# Altium schematic sheet Pressure_sensors.SchDoc
size A; SheetNumber: 4; SheetTotal: 7
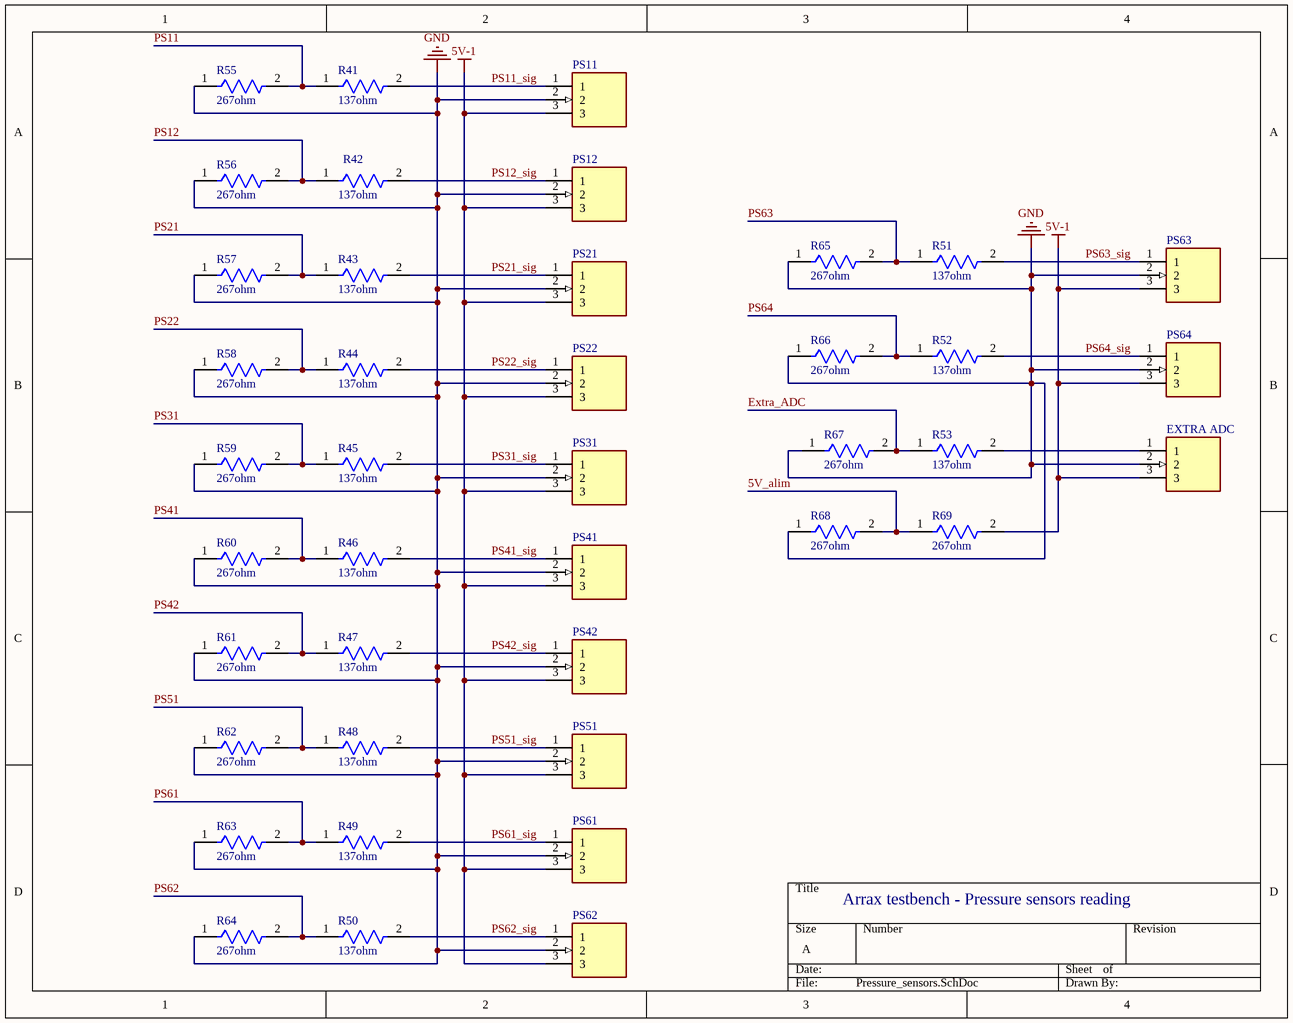
[diagram p0: Pressure_sensors.SchDoc]

## Parts
EXTRA_ADC  640456-3  [HDRV3W107P0X254_1X3_762X572X1080P]  (value not drawn)
PS11  640456-3  [HDRV3W107P0X254_1X3_762X572X1080P]  (value not drawn)
PS12  640456-3  [HDRV3W107P0X254_1X3_762X572X1080P]  (value not drawn)
PS21  640456-3  [HDRV3W107P0X254_1X3_762X572X1080P]  (value not drawn)
PS22  640456-3  [HDRV3W107P0X254_1X3_762X572X1080P]  (value not drawn)
PS31  640456-3  [HDRV3W107P0X254_1X3_762X572X1080P]  (value not drawn)
PS41  640456-3  [HDRV3W107P0X254_1X3_762X572X1080P]  (value not drawn)
PS42  640456-3  [HDRV3W107P0X254_1X3_762X572X1080P]  (value not drawn)
PS51  640456-3  [HDRV3W107P0X254_1X3_762X572X1080P]  (value not drawn)
PS61  640456-3  [HDRV3W107P0X254_1X3_762X572X1080P]  (value not drawn)
PS62  640456-3  [HDRV3W107P0X254_1X3_762X572X1080P]  (value not drawn)
PS63  640456-3  [HDRV3W107P0X254_1X3_762X572X1080P]  (value not drawn)
PS64  640456-3  [HDRV3W107P0X254_1X3_762X572X1080P]  (value not drawn)
R41  137ohm  [FP-RP73P-2A-MFG]
R42  137ohm  [FP-RP73P-2A-MFG]
R43  137ohm  [FP-RP73P-2A-MFG]
R44  137ohm  [FP-RP73P-2A-MFG]
R45  137ohm  [FP-RP73P-2A-MFG]
R46  137ohm  [FP-RP73P-2A-MFG]
R47  137ohm  [FP-RP73P-2A-MFG]
R48  137ohm  [FP-RP73P-2A-MFG]
R49  137ohm  [FP-RP73P-2A-MFG]
R50  137ohm  [FP-RP73P-2A-MFG]
R51  137ohm  [FP-RP73P-2A-MFG]
R52  137ohm  [FP-RP73P-2A-MFG]
R53  137ohm  [FP-RP73P-2A-MFG]
R55  267ohm  [FP-RP73P-2A-MFG]
R56  267ohm  [FP-RP73P-2A-MFG]
R57  267ohm  [FP-RP73P-2A-MFG]
R58  267ohm  [FP-RP73P-2A-MFG]
R59  267ohm  [FP-RP73P-2A-MFG]
R60  267ohm  [FP-RP73P-2A-MFG]
R61  267ohm  [FP-RP73P-2A-MFG]
R62  267ohm  [FP-RP73P-2A-MFG]
R63  267ohm  [FP-RP73P-2A-MFG]
R64  267ohm  [FP-RP73P-2A-MFG]
R65  267ohm  [FP-RP73P-2A-MFG]
R66  267ohm  [FP-RP73P-2A-MFG]
R67  267ohm  [FP-RP73P-2A-MFG]
R68  267ohm  [FP-RP73P-2A-MFG]
R69  267ohm  [FP-RP73P-2A-MFG]

## Nets
5V-1: EXTRA_ADC.3 PS11.3 PS12.3 PS21.3 PS22.3 PS31.3 PS41.3 PS42.3 PS51.3 PS61.3 PS62.3 PS63.3 PS64.3 R69.2
GND: EXTRA_ADC.2 PS11.2 PS12.2 PS21.2 PS22.2 PS31.2 PS41.2 PS42.2 PS51.2 PS61.2 PS62.2 PS63.2 PS64.2 R55.1 R56.1 R57.1 R58.1 R59.1 R60.1 R61.1 R62.1 R63.1 R64.1 R65.1 R66.1 R67.1 R68.1
5V_alim: R68.2 R69.1
Extra_ADC: R53.1 R67.2
PS11: R41.1 R55.2
PS11_sig: PS11.1 R41.2
PS12: R42.1 R56.2
PS12_sig: PS12.1 R42.2
PS21: R43.1 R57.2
PS21_sig: PS21.1 R43.2
PS22: R44.1 R58.2
PS22_sig: PS22.1 R44.2
PS31: R45.1 R59.2
PS31_sig: PS31.1 R45.2
PS41: R46.1 R60.2
PS41_sig: PS41.1 R46.2
PS42: R47.1 R61.2
PS42_sig: PS42.1 R47.2
PS51: R48.1 R62.2
PS51_sig: PS51.1 R48.2
PS61: R49.1 R63.2
PS61_sig: PS61.1 R49.2
PS62: R50.1 R64.2
PS62_sig: PS62.1 R50.2
PS63: R51.1 R65.2
PS63_sig: PS63.1 R51.2
PS64: R52.1 R66.2
PS64_sig: PS64.1 R52.2
NetEXTRA_ADC_1: EXTRA_ADC.1 R53.2

## Notes on the sheet
- Arrax testbench - Pressure sensors reading

## Library data of the parts
EXTRA_ADC PS11 PS12 PS21 PS22 PS31 PS41 PS42 PS51 PS61-PS64 = 640456-3: Connector; Manufacturer_Name: TE Connectivity; Datasheet Link: http://www.te.com/commerce/DocumentDelivery/DDEController?Action=showdoc&DocId=Customer+Drawing%7F640456%7FW3%7Fpdf%7FEnglish%7FENG_CD_640456_W3.pdf%7F640456-3; Height: 10.795mm; Manufacturer_Part_Number: 640456-3; Mouser Part Number: 571-6404563; Mouser Price/Stock: https://www.mouser.co.uk/ProductDetail/TE-Connectivity-AMP/640456-3?qs=%2F35zJ5USjonzBh%2Fz7jaWrQ%3D%3D; Arrow Part Number: 640456-3; Arrow Price/Stock: https://www.arrow.com/en/products/640456-3/te-connectivity?region=nac
R41-R53 = CMP-03211-001043-1: RP73P 0805 137Ω 0.25W 25ppm/°C 0.10% 150V; Manufacturer Part Number: RP73PF2A137RBTDF; Manufacturer: TE Connectivity; Tolerance: 0.001; Temperature Coefficient: 25ppm/°C; Composition: Thin Film; Temperature Range High: +155°C; Automotive: No; Ipc Land Pattern Name: RESC200125X55; Lead Free: Yes; Device Class L2: Resistors; Temperature: -55°C to +155°C; Resistance: 137Ω; Series: RP73P; Category: Res; Temperature Range Low: -55°C; RoHS: TRUE; Voltage Rating: 150V; Value: 137Ω; Height: 0.65mm; ComponentLink2URL: https://www.te.com/commerce/DocumentDelivery/DDEController?Action=srchrtrv&DocNm=1773272&DocType=DS&DocLang=English; Package: RP73P-2A; Power Rating: 0.25W; ComponentLink2Description: Datasheet; Device Class L1: Passive Components; Device Class L3: Chip SMD Resistors; Octopart: https://octopart.com/rp73pf2a137rbtdf-te+connectivity-45466427
R55-R69 = CMP-03211-003395-1: RP73P 0805 267Ω 0.25W 25ppm/°C 0.10% 150V; Manufacturer Part Number: RP73PF2A267RBTDF; Manufacturer: TE Connectivity; Tolerance: 0.001; RoHS: TRUE; Composition: Thin Film; Device Class L1: Passive Components; Temperature Coefficient: 25ppm/°C; Height: 0.65mm; Temperature Range Low: -55°C; Category: Res; Temperature Range High: +155°C; Value: 267Ω; Device Class L2: Resistors; Lead Free: Yes; ComponentLink2Description: Datasheet; ComponentLink2URL: https://www.te.com/commerce/DocumentDelivery/DDEController?Action=srchrtrv&DocNm=1773272&DocType=DS&DocLang=English; Device Class L3: Chip SMD Resistors; Voltage Rating: 150V; Power Rating: 0.25W; Automotive: No; Series: RP73P; Ipc Land Pattern Name: RESC200125X55; Package: RP73P-2A; Temperature: -55°C to +155°C; Octopart: https://octopart.com/rp73pf2a267rbtdf-te+connectivity-45466701; Resistance: 267Ω